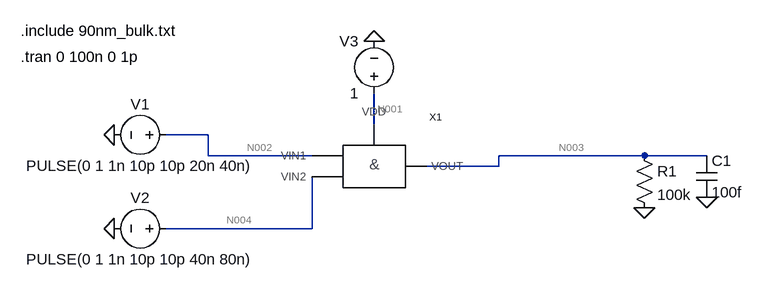
[diagram p0: schematic testingand.asc]
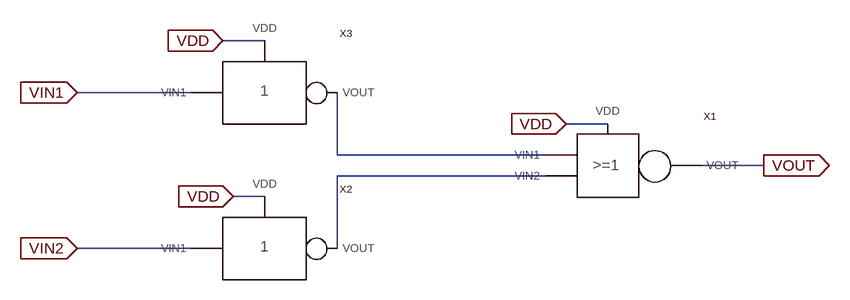
[diagram p1: sub-circuit dimaand.asc]
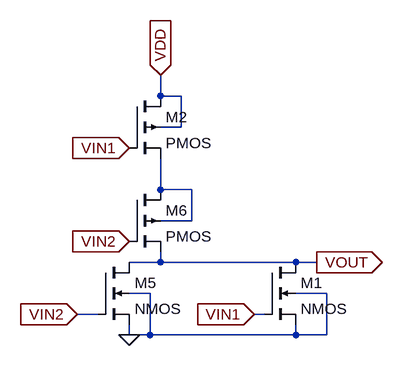
[diagram p2: sub-circuit dimanor.asc]
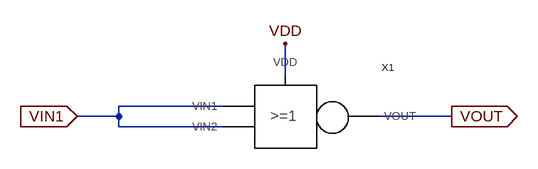
[diagram p3: sub-circuit dimanot.asc]
testingand.asc, the LTspice schematic file:
Version 4
SHEET 1 960 680
WIRE 384 144 384 96
WIRE 128 160 64 160
WIRE 128 192 128 160
WIRE 288 192 128 192
WIRE 800 192 576 192
WIRE 896 192 800 192
WIRE 576 208 576 192
WIRE 576 208 464 208
WIRE 288 304 288 224
WIRE 288 304 64 304
FLAG -16 160 0
FLAG -16 304 0
FLAG 384 16 0
FLAG 800 272 0
FLAG 896 256 0
SYMBOL voltage 80 160 R90
WINDOW 0 -32 56 VBottom 2
WINDOW 3 32 56 VTop 2
WINDOW 123 0 0 Left 0
WINDOW 39 0 0 Left 0
SYMATTR InstName V1
SYMATTR Value PULSE(0 1 1n 10p 10p 20n 40n)
SYMBOL voltage 80 304 R90
WINDOW 0 -32 56 VBottom 2
WINDOW 3 32 56 VTop 2
WINDOW 123 0 0 Left 0
WINDOW 39 0 0 Left 0
SYMATTR InstName V2
SYMATTR Value PULSE(0 1 1n 10p 10p 40n 80n)
SYMBOL voltage 384 112 R180
WINDOW 0 24 96 Left 2
WINDOW 3 24 16 Left 2
WINDOW 123 0 0 Left 0
WINDOW 39 0 0 Left 0
SYMATTR InstName V3
SYMATTR Value 1
SYMBOL cap 880 192 R0
SYMATTR InstName C1
SYMATTR Value 100f
SYMBOL res 784 176 R0
SYMATTR InstName R1
SYMATTR Value 100k
SYMBOL dimaand 384 208 R0
SYMATTR InstName X1
TEXT -160 0 Left 2 !.include 90nm_bulk.txt
TEXT -160 40 Left 2 !.tran 0 100n 0 1p

dimaand.asc, the sub-circuit schematic file:
Version 4
SHEET 1 880 680
WIRE -176 0 -240 0
WIRE -288 80 -464 80
WIRE 352 128 288 128
WIRE -64 176 -64 80
WIRE 256 176 -64 176
WIRE 592 192 496 192
WIRE 256 208 -64 208
WIRE -176 240 -224 240
WIRE -288 320 -464 320
WIRE -64 320 -64 208
FLAG -240 0 VDD
IOPIN -240 0 In
FLAG -464 320 VIN2
IOPIN -464 320 In
FLAG -464 80 VIN1
IOPIN -464 80 In
FLAG 592 192 VOUT
IOPIN 592 192 Out
FLAG 288 128 VDD
IOPIN 288 128 In
FLAG -224 240 VDD
IOPIN -224 240 In
SYMBOL dimanor 352 176 R0
SYMATTR InstName X1
SYMBOL dimanot -176 320 R0
SYMATTR InstName X2
SYMBOL dimanot -176 80 R0
SYMATTR InstName X3

dimanor.asc, the sub-circuit schematic file:
Version 4
SHEET 1 880 680
WIRE 464 64 464 32
WIRE 496 64 464 64
WIRE 496 112 496 64
WIRE 496 112 464 112
WIRE 464 208 464 160
WIRE 512 208 464 208
WIRE 512 256 512 208
WIRE 512 256 464 256
WIRE 464 320 464 304
WIRE 464 320 416 320
WIRE 672 320 464 320
WIRE 704 320 672 320
WIRE 448 368 416 368
WIRE 720 368 672 368
WIRE 368 400 336 400
WIRE 624 400 608 400
WIRE 416 432 416 416
WIRE 448 432 448 368
WIRE 448 432 416 432
WIRE 672 432 672 416
WIRE 672 432 448 432
WIRE 720 432 720 368
WIRE 720 432 672 432
FLAG 416 144 VIN1
IOPIN 416 144 In
FLAG 416 288 VIN2
IOPIN 416 288 In
FLAG 608 400 VIN1
IOPIN 608 400 In
FLAG 336 400 VIN2
IOPIN 336 400 In
FLAG 416 432 0
FLAG 464 32 VDD
IOPIN 464 32 In
FLAG 704 320 VOUT
IOPIN 704 320 Out
SYMBOL nmos4 368 320 R0
SYMATTR InstName M5
SYMATTR Value2 l=90n w=200n
SYMBOL nmos4 624 320 R0
SYMATTR InstName M1
SYMATTR Value2 l=90n w=200n
SYMBOL pmos4 416 64 R0
SYMATTR InstName M2
SYMATTR Value2 l=90n w=400n
SYMBOL pmos4 416 208 R0
SYMATTR InstName M6
SYMATTR Value2 l=90n w=400n

dimanot.asc, the sub-circuit schematic file:
Version 4
SHEET 1 880 680
WIRE 272 112 272 64
WIRE 176 160 16 160
WIRE 16 176 16 160
WIRE 16 176 -48 176
WIRE 528 176 416 176
WIRE 16 192 16 176
WIRE 176 192 16 192
FLAG -48 176 VIN1
IOPIN -48 176 In
FLAG 272 64 VDD
FLAG 528 176 VOUT
IOPIN 528 176 Out
SYMBOL dimanor 272 160 R0
SYMATTR InstName X1

The netlist it stands for:
* testingand.asc
V1 N002 0 PULSE(0 1 1n 10p 10p 20n 40n)
V2 N004 0 PULSE(0 1 1n 10p 10p 40n 80n)
V3 N001 0 1
C1 N003 0 100f
R1 N003 0 100k
XX1 N002 N004 N001 N003 dimaand

* block symbol definitions
.subckt dimaand VIN1 VIN2 VDD VOUT
XX1 N001 N002 VDD VOUT dimanor
XX2 VIN2 VDD N002 dimanot
XX3 VIN1 VDD N001 dimanot
.ends dimaand

.subckt dimanor VIN1 VIN2 VDD VOUT
M5 VOUT VIN2 0 0 NMOS l=90n w=200n
M1 VOUT VIN1 0 0 NMOS l=90n w=200n
M2 VDD VIN1 N001 VDD PMOS l=90n w=400n
M6 N001 VIN2 VOUT N001 PMOS l=90n w=400n
.ends dimanor

.subckt dimanot VIN1 VDD VOUT
XX1 VIN1 VIN1 VDD VOUT dimanor
.ends dimanot

.model NMOS NMOS
.model PMOS PMOS
.lib standard.mos
.include 90nm_bulk.txt
.tran 0 100n 0 1p
.backanno
.end

* Results of the author's LTspice run, read from the files saved beside the schematic
* Operating Point, zero values left out:
*   V(n001) = 1 V
*   V(n003) = 680.9 nV
*   I(R1) = 6.809 pA
*   I(V3) = -22.44 nA
*   I(V2) = 261.7 pA
*   I(V1) = 261.7 pA
*   Ix(x1:VIN1) = -261.7 pA
*   Ix(x1:VIN2) = -261.7 pA
*   Ix(x1:VDD) = 22.44 nA
*   Ix(x1:VOUT) = -6.809 pA
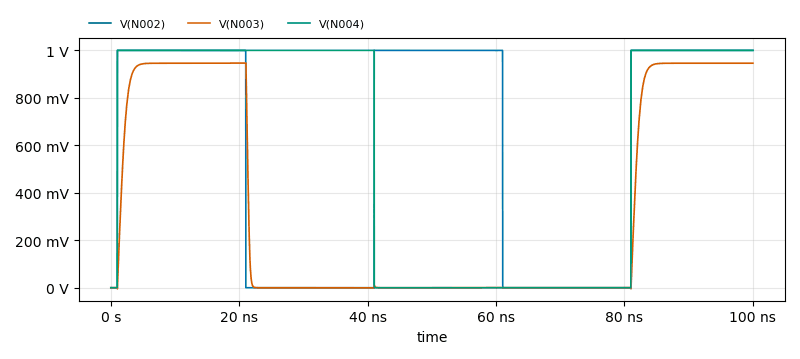
[diagram p4: Transient Analysis of testingand.asc, plotted from the saved traces]
* Transient Analysis, 1 run:
*   V(N002): min 0 V, max 1 V, average 590.1 mV, rms 768.2 mV, last 1 V
*   V(N003): min -4.511 mV, max 946.5 mV, average 355.2 mV, rms 572.8 mV, last 945.9 mV
*   V(N004): min 0 V, max 1 V, average 590 mV, rms 768.1 mV, last 1 V